# EAGLE design controller_2L_up (EAGLE 5.00)
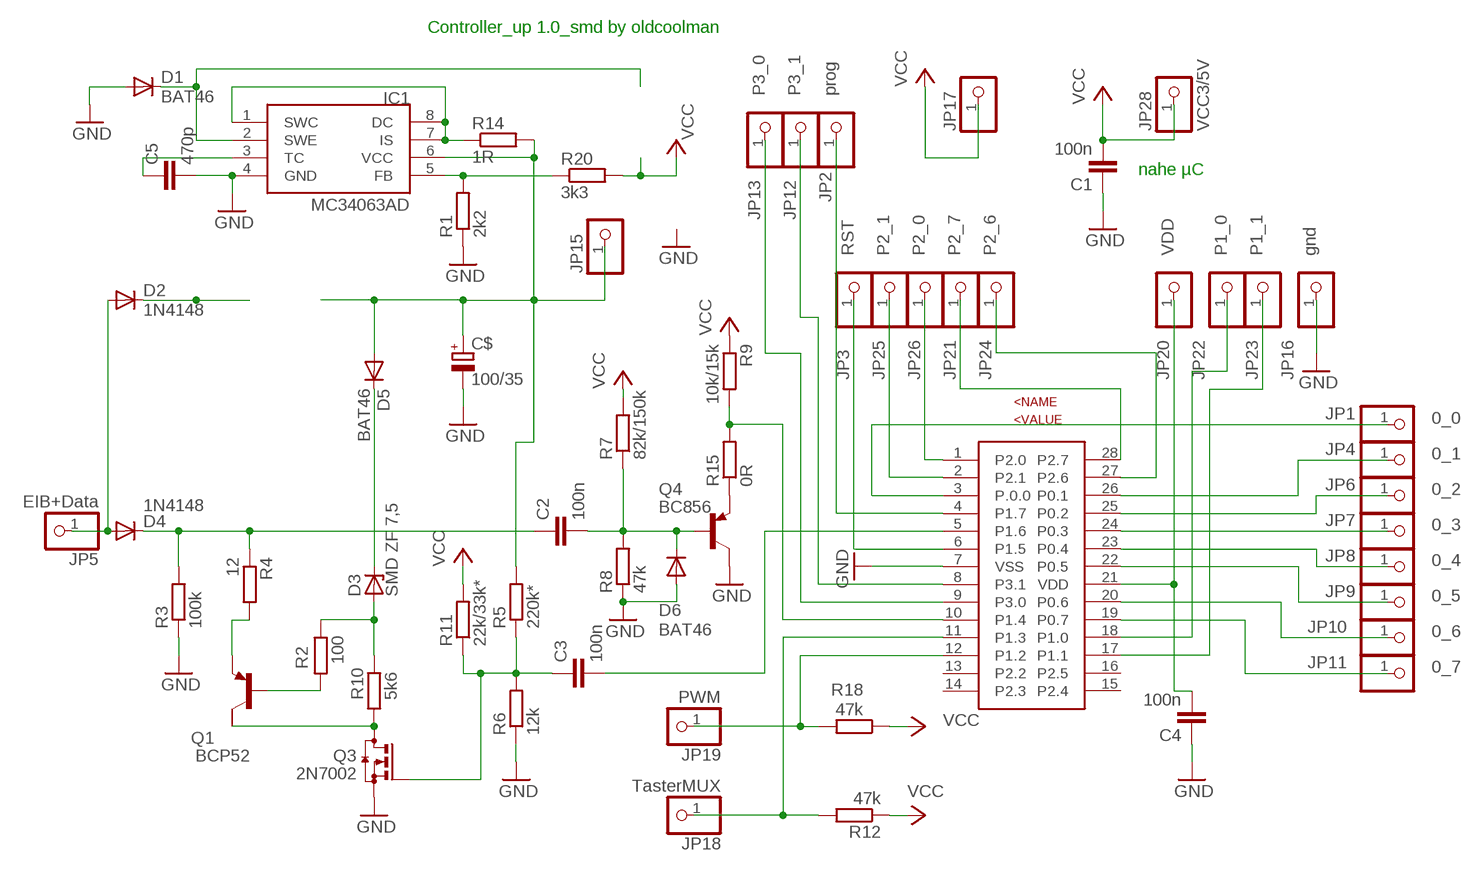
[diagram p0: schematic, sheet 1]

## Parts
C1  100n  C-EUC1206  [C1206]
C2  100n  C-EUC1206  [C1206]
C3  100n  C-EUC1206  [C1206]
C4  100n  C-EUC1206  [C1206]
C5  470p  C-EUC1206  [C1206]
C$  100/35  C_EU_HE3,3X13LIEGEND  [E3,3-7,5X13]
D1  BAT46  DIODE-MINIMELF  [MINIMELF]
D2  1N4148  DIODE-MINIMELF  [MINIMELF]
D3  SMD ZF 7,5  ZPD  [MINIMELF]
D4  1N4148  DIODE-MINIMELF  [MINIMELF]
D5  BAT46  DIODE-MINIMELF  [MINIMELF]
D6  BAT46  DIODE-MINIMELF  [MINIMELF]
IC1  MC34063AD  [SOIC8]
JP1  0_0  PINHD-1X1  [1X01]
JP2  prog  PINHD-1X1  [1X01]
JP3  RST  PINHD-1X1  [1X01]
JP4  0_1  PINHD-1X1  [1X01]
JP5  EIB+Data  PINHD-1X1  [1X01]
JP6  0_2  PINHD-1X1  [1X01]
JP7  0_3  PINHD-1X1  [1X01]
JP8  0_4  PINHD-1X1  [1X01]
JP9  0_5  PINHD-1X1  [1X01]
JP10  0_6  PINHD-1X1  [1X01]
JP11  0_7  PINHD-1X1  [1X01]
JP12  P3_1  PINHD-1X1  [1X01]
JP13  P3_0  PINHD-1X1  [1X01]
JP15  PINHD-1X1  [1X01]
JP16  gnd  PINHD-1X1  [1X01]
JP17  PINHD-1X1  [1X01]
JP18  TasterMUX  PINHD-1X1  [1X01]
JP19  PWM  PINHD-1X1  [1X01]
JP20  VDD  PINHD-1X1  [1X01]
JP21  P2_7  PINHD-1X1  [1X01]
JP22  P1_0  PINHD-1X1  [1X01]
JP23  P1_1  PINHD-1X1  [1X01]
JP24  P2_6  PINHD-1X1  [1X01]
JP25  P2_1  PINHD-1X1  [1X01]
JP26  P2_0  PINHD-1X1  [1X01]
JP28  VCC3/5V  PINHD-1X1  [1X01]
Q1  BCP52  FZT753SMD  [SOT223]
Q3  2N7002  BSS123  [SOT23]
Q4  BC856  BC856ALT1SMD  [SOT23-BEC]
R1  2k2  R-EU_R1206  [R1206]
R2  100  R-EU_M1206  [M1206]
R3  100k  R-EU_M1206  [M1206]
R4  12  R-EU_R1206  [R1206]
R5  220k*  R-EU_R1206  [R1206]
R6  12k  R-EU_M1206  [M1206]
R7  82k/150k  R-EU_R1206  [R1206]
R8  47k  R-EU_M1206  [M1206]
R9  10k/15k  R-EU_R1206  [R1206]
R10  5k6  R-EU_M1206  [M1206]
R11  22k/33k*  R-EU_R1206  [R1206]
R12  47k  R-EU_M1206  [M1206]
R14  1R  R-EU_M1206  [M1206]
R15  0R  R-EU_M1206  [M1206]
R18  47k  R-EU_M1206  [M1206]
R20  3k3  R-EU_M1206  [M1206]
U$1  LPC936TSSOP28  [TSSOP28]

## Nets
GND: C1.1 C4.1 C5.2 C$.- D1.A D6.A IC1.4(GND) JP16.1 Q3.2(S) Q4.C R1.1 R3.1 R6.1 R8.1 U$1.7(VSS)
N$1: R9.2 R15.2 U$1.10(P1.4)
N$2: C2.2 D6.C Q4.B R7.1 R8.2
N$3: IC1.5(FB) R1.2 R20.1
N$4: IC1.1(SWC) IC1.7(IS) IC1.8(DC) R14.1
N$5: C3.2 U$1.5(P1.6)
N$6: Q1.2(C) Q3.3(D) R10.1
N$7: C$.+ D5.A IC1.6(VCC) JP15.1 R5.2 R14.2
N$8: D2.C
N$9: C2.1 D4.C R3.2 R4.1
N$10: D1.C IC1.2(SWE)
N$11: D3.A R2.1 R10.2
N$12: Q1.3(E) R4.2
N$13: C5.1 IC1.3(TC)
N$14: Q1.1(B) R2.2
N$15: JP2.1 U$1.4(P1.7)
N$16: JP21.1 U$1.28(P2.7)
N$17: JP4.1 U$1.26(P0.1)
N$18: JP1.1 U$1.3(P.0.0)
N$19: JP6.1 U$1.25(P0.2)
N$20: JP7.1 U$1.24(P0.3)
N$21: JP8.1 U$1.23(P0.4)
N$22: JP9.1 U$1.22(P0.5)
N$23: JP10.1 U$1.20(P0.6)
N$24: JP11.1 U$1.19(P0.7)
N$25: JP12.1 U$1.8(P3.1)
N$26: JP13.1 U$1.9(P3.0)
N$28: D2.A D4.A JP5.1
N$29: JP22.1 U$1.18(P1.0)
N$30: JP23.1 U$1.17(P1.1)
N$31: JP3.1 U$1.6(P1.5)
N$32: C4.2 JP20.1 U$1.21(VDD)
N$33: JP19.1 R18.2 U$1.12(P1.2)
N$34: C3.1 Q3.1(G) R5.1 R6.2 R11.1
N$35: Q4.E R15.1
N$36: JP24.1 U$1.27(P2.6)
N$37: JP26.1 U$1.1(P2.0)
N$38: JP25.1 U$1.2(P2.1)
N$40: D3.C D5.C
N$42: JP18.1 R12.2 U$1.11(P1.3)
VCC: C1.2 JP17.1 JP28.1 R7.2 R9.1 R11.2 R12.1 R18.1 R20.2
Unconnected: Q1.4(C/) U$1.13(P2.2) U$1.14(P2.3) U$1.15(P2.4) U$1.16(P2.5)

## Notes on the sheet
- Controller_up 1.0_smd by oldcoolman
- nahe µC

## Library data of the parts
C1-C5 = rcl:C-EU: CAPACITOR, European symbol
C$ = rcl:C_EU_H
D1 D2 D4-D6 = diode:DIODE-: DIODE
D3 = diode:ZPD: Z DIODE 500 mW
IC1 = mc34063:MC34063
JP1-JP13 JP15-JP26 JP28 = pinhead:PINHD-1X1: PIN HEADER
Q1 = transistor-pnp:FZT753SMD: PNP Transistor
Q3 = transistor-small-signal:BSS123: N-CHANNEL MOS FET
Q4 = transistor-pnp:BC856*: PNP Transistror
R1-R12 R14 R15 R18 R20 = rcl:R-EU_: RESISTOR, European symbol
U$1 = freebuslpc:LPC936: C51 Based Microcontroller LPC936 ADC and 16kbyte Flash

## Board
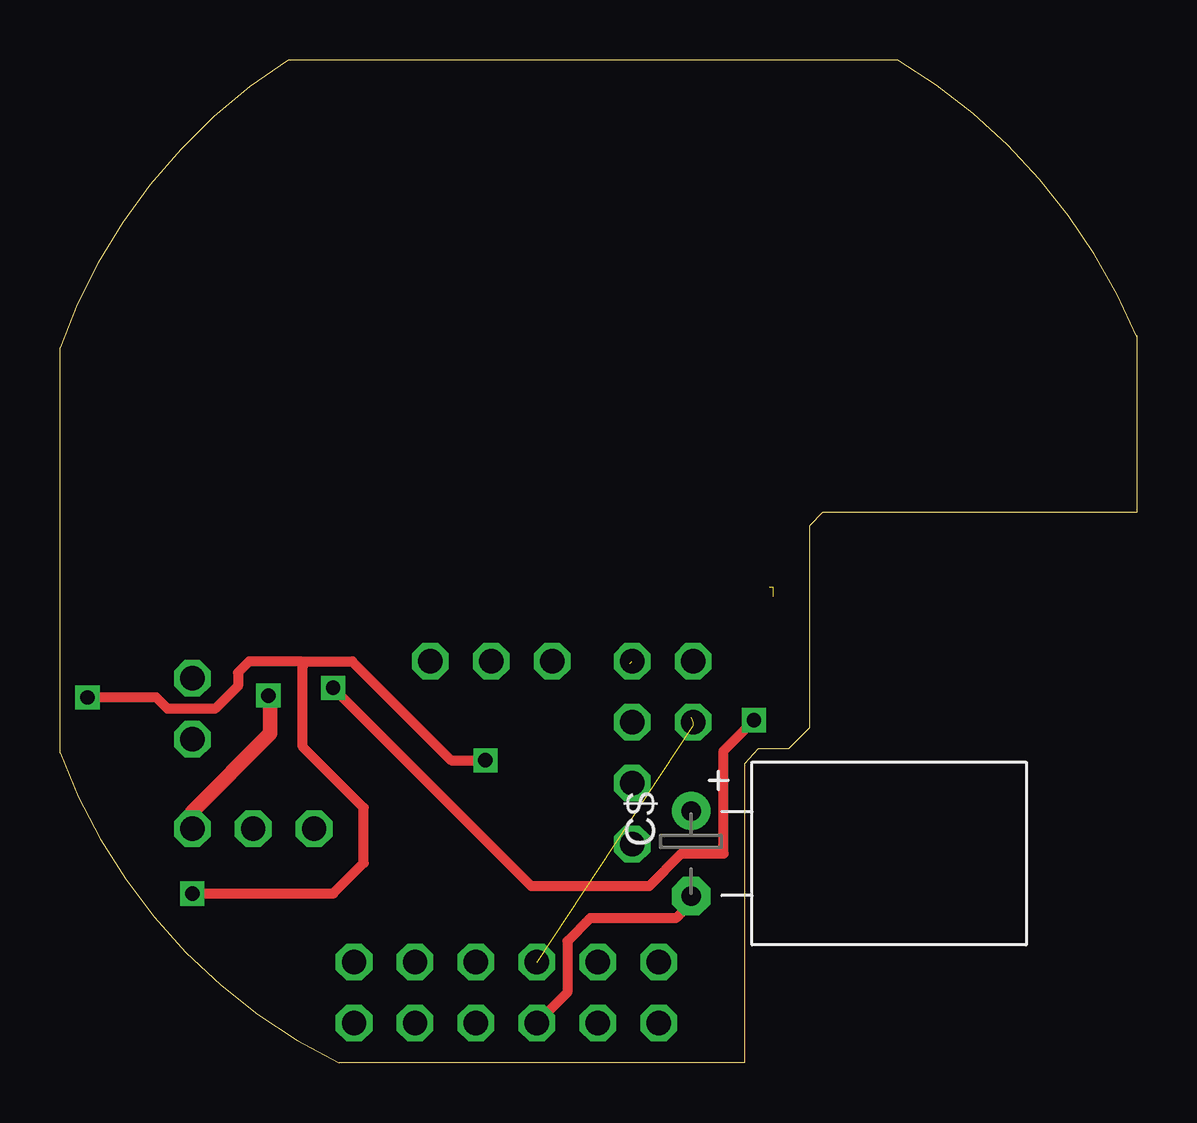
[diagram p1: board, top side]
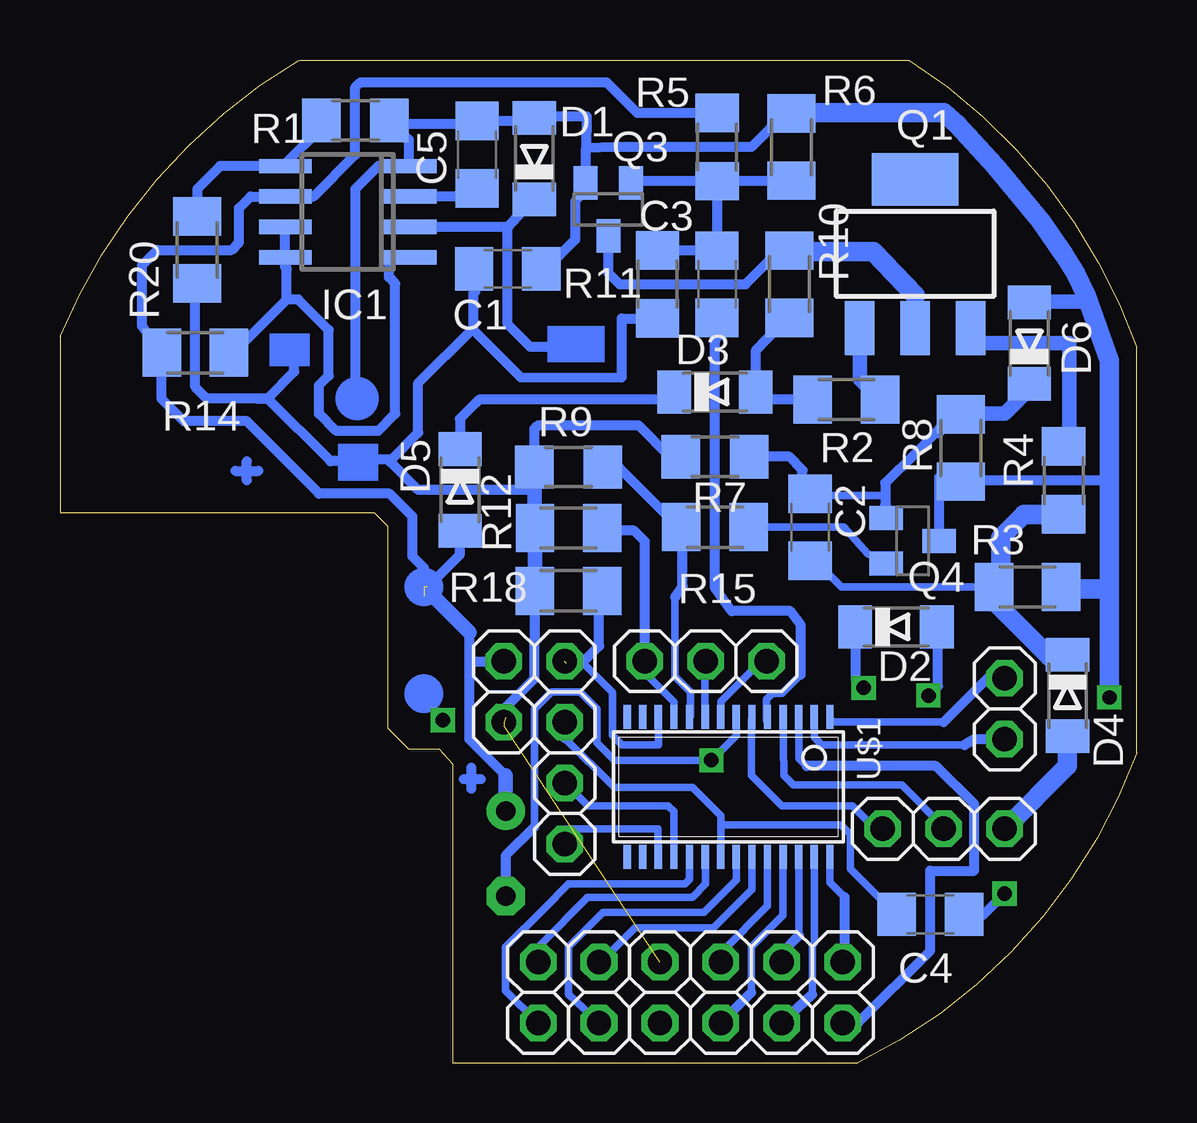
[diagram p2: board, bottom side, seen from below]

Size 44.89 x 41.81 mm. Coordinates in mm from the lower left corner, seen from the top.
Outline: 34.91,41.81 9.5,41.81 arc38 0,29.82
Outline: 0.01,12.92 0,29.81
Outline: 44.89,30.28 arc36 34.92,41.81
Outline: 0.01,12.93 arc44 11.63,0 28.53,0 28.53,4.92 28.53,12.46 29.09,13.1 30.36,13.1 31.23,13.97 31.23,22.38 31.79,22.94 44.88,22.94 44.88,30.32
Copper layers (1*16): Top 0.035mm / dielectric 1.5mm / Bottom 0.035mm
Design rules "default": minimum track width 10mil, minimum drill 24mil, track to track 8mil, track to pad 8mil, pad to pad 8mil, via to via 8mil, smd to smd 8mil, copper to edge 40mil, drill to drill 8mil, minimum pad ring 10mil, minimum via ring 8mil, stop-mask expansion 4mil, vias tented up to drill 0mil, thermal gap 10mil

### Footprints (pad centres in the part's own frame; a part is rotated, then mirrored left to right if it is on the bottom)
C1206 = smd 1.6 x 1.8: 1 -1.4,0; 2 1.4,0
E3,3-7,5X13 = drill 0.813 pad 1.6 round: + -1.778,0 | drill 0.813 pad 1.6 octagon: - 1.778,0
MINIMELF = smd 1.4 x 1.8: A 1.7,0; C -1.7,0
SOIC8 = smd 0.6 x 2.2: 1 -1.905,-2.6; 2 -0.635,-2.6; 3 0.635,-2.6; 4 1.905,-2.6; 5 1.905,2.6; 6 0.635,2.6; 7 -0.635,2.6; 8 -1.905,2.6
1X01 = drill 1.016 octagon: 1 0,0
SOT223 = smd 1.219 x 2.235: 1 -2.311,-3.099; 2 0,-3.099; 3 2.311,-3.099 | smd 3.6 x 2.2: 4 0,3.099
SOT23 = smd 1 x 1.4: 1 -0.95,-1.1; 2 0.95,-1.1; 3 0,1.1
SOT23-BEC = smd 1 x 1.4: B -0.95,-1.1; C 0,1.1; E 0.95,-1.1
R1206 = smd 1.6 x 1.803: 1 -1.422,0; 2 1.422,0
M1206 = smd 1.6 x 2: 1 -1.4,0; 2 1.4,0
TSSOP28 = smd 0.305 x 0.991: 1 -4.225,-2.918; 2 -3.575,-2.918; 3 -2.925,-2.918; 4 -2.275,-2.918; 5 -1.625,-2.918; 6 -0.975,-2.918; 7 -0.325,-2.918; 8 0.325,-2.918; 9 0.975,-2.918; 10 1.625,-2.918; 11 2.275,-2.918; 12 2.925,-2.918; 13 3.575,-2.918; 14 4.225,-2.918; 15 4.225,2.918; 16 3.575,2.918; 17 2.925,2.918; 18 2.275,2.918; 19 1.625,2.918; 20 0.975,2.918; 21 0.325,2.918; 22 -0.325,2.918; 23 -0.975,2.918; 24 -1.625,2.918; 25 -2.275,2.918; 26 -2.925,2.918; 27 -3.575,2.918; 28 -4.225,2.918

### Placement (x,y rotation side)
C1  26.23,33.1 180 bottom
C2  13.62,22.33 90 bottom
C3  17.5,32.46 270 bottom
C4  8.61,6.19 180 bottom
C5  27.5,37.86 90 bottom
C$  26.31,8.73 270 top
D1  25.12,37.7 90 bottom
D2  10.04,18.18 0 bottom
D3  17.59,27.97 0 bottom
D4  2.89,15.32 270 bottom
D5  28.21,23.89 270 bottom
D6  4.48,30 90 bottom
IC1  32.9,35.48 90 bottom
JP1  12.26,1.67 0 bottom
JP2  8.05,9.76 0 bottom
JP3  10.59,9.76 0 bottom
JP4  14.8,4.21 0 bottom
JP5  5.51,9.76 0 bottom
JP6  17.34,1.67 0 bottom
JP7  17.34,4.21 0 bottom
JP8  22.42,4.21 0 bottom
JP9  22.42,1.67 0 bottom
JP10  24.96,4.21 0 bottom
JP11  24.96,1.67 0 bottom
JP12  15.44,16.75 0 bottom
JP13  17.98,16.75 0 bottom
JP15  26.39,16.75 0 bottom
JP16  19.88,1.67 0 bottom
JP17  26.39,14.21 0 bottom
JP18  20.52,16.75 0 bottom
JP19  23.85,16.75 0 bottom
JP20  23.85,14.21 0 bottom
JP21  12.26,4.21 0 bottom
JP22  23.85,11.66 0 bottom
JP23  23.85,9.13 0 bottom
JP24  14.8,1.67 0 bottom
JP25  5.51,13.49 0 bottom
JP26  5.51,16.03 0 bottom
JP28  19.88,4.21 0 bottom
Q1  9.24,33.73 0 bottom
Q3  22.03,35.58 180 bottom
Q4  9.35,21.76 270 bottom
R1  32.58,39.29 180 bottom
R2  12.11,27.65 0 bottom
R3  4.56,19.84 180 bottom
R4  3.05,24.29 90 bottom
R5  17.5,38.18 90 bottom
R6  14.4,38.18 270 bottom
R7  17.59,25.27 180 bottom
R8  7.34,25.64 90 bottom
R9  23.69,24.84 0 bottom
R10  14.48,32.46 270 bottom
R11  19.98,32.46 270 bottom
R12  23.69,22.3 0 bottom
R14  39.25,29.61 180 bottom
R15  17.59,22.33 180 bottom
R18  23.69,19.68 0 bottom
R20  39.17,33.89 270 bottom
U$1  17.02,11.51 180 bottom

### Tracks (layer width: path | path; a pad name or v marks a point on that pad's centre or on a via)
GND  (via drill 0.6)
  Top 0.406: JP16.1 | JP16.1 21.15,2.94 21.15,5.08 22.1,6.03 25.67,6.03 26.55,6.91 C$.- | v17.74,12.62 16.31,12.62 12.18,16.75 10.04,16.75 | 10.04,16.75 10.12,16.51 10.12,13.18 12.66,10.64 12.66,8.33 11.39,7.06 v5.51,7.06 | 10.04,16.75 7.89,16.75 7.42,16.27 7.42,15.72 6.47,14.76 4.48,14.76 4,15.24 v1.15,15.24
  Bottom 0.254: 1.94,31.92 1.94,31.91 | 1.94,31.92 1.95,31.92 | 2.1,31.99 1.94,31.92
  Bottom 0.305: U$1.7 16.7,13.66 v17.74,12.62 21.78,12.62 22.5,13.33 22.5,14.76 23.21,15.47 24.4,15.47 25.12,14.76 25.12,11.67 | 25.12,11.67 25.12,9.84 | 25.12,11.67 | C4.1 7.13,5.98
  Bottom 0.406: 30.36,38.49 R1.1 | 30.36,38.49 30.36,37.39 | 30.36,37.39 IC1.4 | 30.36,37.39 31.63,37.39 32.58,36.43 32.58,27.86 | 1.15,19.76 1.15,18.97 0.99,19.29 | 30.36,38.49 30.36,38.5 30.99,39.13 27.66,39.13 27.5,39.29 C5.2 25.31,39.26 25.16,39.4 D1.A 24.85,39.4 24.8,39.45 22.92,39.45 22.94,38.13 | 2.6,19.76 R3.1 | 25.12,9.84 26.31,8.65 C$.- | 1.15,24.29 0.99,24.37 1.07,24.29 6.59,24.29 7.42,24.45 7.23,24.24 R8.1 7.49,24.51 8.25,24.42 Q4.C | 1.15,24.29 | 22.94,38.13 21.78,38.18 16.07,38.18 14.64,39.61 14.61,39.58 R6.1 14.24,39.61 | 22.94,38.13 22.98,38.09 Q3.2 22.98,36.36 23.42,35.92 23.42,34.32 24.64,33.1 C1.1 | 1.92,31.93 1.93,31.93 1.95,31.92 2.12,31.74 | 7.26,6.19 C4.1 6.39,6.19 v5.51,7.06 | v1.15,15.24 1.15,15.48 | v17.74,12.62
  Bottom 0.61: D6.A 4.33,31.74 4.32,31.75 4.32,31.74 2.12,31.74
  Bottom 0.813: 2.6,19.76 1.15,19.76 1.15,15.48 1.15,15.32 | 1.15,18.97 1.15,24.29 1.15,29.29 2.1,31.99 2.58,32.94 3.02,33.67 4,35.08 5.91,37.39 7.5,39.13 8.05,39.61 14.24,39.61
N$1
  Bottom 0.305: 19.25,19.42 19.24,18.1 19.24,16.11 18.61,15.48 18.61,14.45 18.65,14.41 U$1.10
  Bottom 0.406: R9.2 22.11,24.69 21.95,24.84 21.61,24.84 19.17,22.41 19.07,22.41 R15.2 | 19.41,22.57 19.3,22.46 R15.2 | R15.2 18.94,22.28 18.94,19.87 19.25,19.42
N$2
  Bottom 0.305: 13.86,23.84 13.62,23.84 13.54,23.65 11.8,23.65 10.46,23.65 Q4.B
  Bottom 0.406: R7.1 14.49,25.27 13.94,24.71 13.94,23.92 13.86,23.84 13.94,23.76 C2.2 | R8.2 8.29,26.24 8.22,26.45 9.24,25.4 10.48,24.18 10.48,23.25 10.45,23.22 Q4.B | 4.62,28.45 4.51,28.35 D6.C
  Bottom 0.61: 4.62,28.45 4.62,27.96 5.51,27.07 7.26,27.07 7.28,27.04 R8.2
N$3
  Bottom 0.406: R20.1 39.17,36.43 38.22,37.39 IC1.5 35.5,37.48 34.01,38.97 R1.2
N$4
  Bottom 0.406: IC1.1 31.15,33.58 31.18,32.75 30.91,32.49 30.91,27.07 31.63,26.35 | IC1.7 35.5,33.16 35.44,33.1 | R14.1 37.66,29.61 35.44,31.83 | 35.44,33.1 IC1.8 | 35.44,31.83 35.44,33.1 | 35.44,31.83 35.44,31.99 | 31.63,26.35 | 31.63,26.35 33.37,26.35 34.09,27.07 34.09,28.26 33.69,28.65 33.69,30.56 34.96,31.83 35.44,31.83
N$5
  Bottom 0.305: 15.43,14.45 15.4,14.41 U$1.5 15.42,14.29 15.43,14.29 15.43,15.16 15.2,15.4 14.8,15.4 14.01,16.19
  Bottom 0.406: C3.2 17.45,30.35 17.59,30.09 17.59,19.79 16.9,18.83 14.45,18.83 14.01,18.26 14.01,16.19
N$6
  Bottom 0.406: R10.1 14.56,33.73 15.04,33.73 16.31,32.46 16.34,32.46 16.35,32.45 21.55,32.45 22.03,32.93 Q3.3 | Q1.2 | 9.24,31.99 | Q1.2 9.24,31.99 | 14.43,33.81 R10.1 | R10.1
  Bottom 0.813: 9.24,31.99 10.99,33.81 14.43,33.81
N$7  (2 unrouted)
  Bottom 0.406: 27.82,16.83 27.82,17.94 | 40.68,29.61 | 40.68,29.61 R14.2 40.65,27.67 39.72,26.75 37.1,26.75 34.09,23.73 31.15,23.73 30.2,22.78 30.2,21.11 29.72,20.64 29.72,19.45 | 40.68,29.61 41.47,30.72 41.47,33.26 40.83,33.89 37.74,33.89 37.42,34.21 37.42,35.64 36.95,36.12 IC1.6 34.33,36.12 32.58,37.86 32.58,40.67 32.37,40.88 22.1,40.88 20.83,39.61 R5.2 | 29.72,19.45 | C$.+ 26.47,10.32 | 27.82,16.83 27.82,15.8 27.82,13.49 26.31,11.99 | JP15.1 27.82,16.74 27.82,16.83 | D5.A 28.21,21.19 29.56,19.84 | R5.2 | R5.2
  Bottom 0.61: 27.82,17.94 29.72,19.84 | C$.+ 26.31,11.99
N$8  (via drill 0.6)
  Top 0.406: v28.93,14.29 27.66,13.02 27.66,8.73 25.91,8.73 24.56,7.38 19.64,7.38 v11.39,15.64
  Bottom 0.406: 11.7,18.21 11.7,18.26 | 11.7,18.21 D2.C | v11.39,15.64 11.7,15.95 11.7,18.21
N$9
  Bottom 0.305: C2.1 13.41,20.93 12.32,19.84 5.75,19.84 5.67,19.92 5.59,19.84 R3.2 | 3.05,22.86 R4.1
  Bottom 0.406: R3.2 5.59,19.87
  Bottom 0.813: 5.67,19.92 5.67,21.91 4.72,22.86 3.05,22.86 | D4.C 3.64,16.94 5.83,19.13 5.83,19.76 5.59,19.84 R3.2
N$10
  Bottom 0.406: D1.C 25.44,35.72 26.23,34.85 | 26.23,34.85 IC1.2 | 26.23,34.85 26.23,30.8 25.28,29.84 24.32,29.84
N$11
  Bottom 0.406: R10.2 14.43,31.11 14.54,31.11 15.87,29.72 D3.A 15.57,27.65 R2.1 | R2.1 13.46,27.65 | R2.1
N$12
  Bottom 0.305: 3.05,25.64 | R4.2 3.05,25.64
  Bottom 0.406: 3.05,25.88 R4.2 | Q1.3
  Bottom 0.61: 3.05,25.88 2.89,25.88 2.81,26.35 2.81,30 6.78,30 6.78,30.56 6.86,30.64 6.87,30.64 Q1.3
N$13
  Bottom 0.406: IC1.3 30.67,36.12 | IC1.3 30.04,36.12 | C5.1 27.63,36.46 28.45,36.12 IC1.3
N$14
  Bottom 0.61: 10.75,27.69 R2.2 | R2.2 10.67,27.62 | Q1.1 11.55,28.5 R2.2
N$15
  Bottom 0.305: U$1.4 14.72,11.99 14.32,11.59 9.8,11.59 7.97,9.76 JP2.1
N$16
  Bottom 0.305: U$1.28 12.8,7.52 12.18,6.91 | JP21.1 12.18,4.52
  Bottom 0.406: 12.18,4.52 12.18,6.91
N$17
  Bottom 0.305: U$1.26 14.1,8.43 14.09,8.41 14.09,5.32
  Bottom 0.406: JP4.1 14.72,4.68 14.09,5.32
N$18
  Bottom 0.305: U$1.3 14.09,14.27 14.09,12.7 13.77,12.38
  Bottom 0.406: JP1.1 11.62,1.67 8.61,4.68 8.61,8.02 6.78,8.02 6.78,10.79 8.37,12.38 13.77,12.38
N$19
  Bottom 0.305: U$1.25 14.75,6.16 16.07,4.84 16.07,2.94
  Bottom 0.406: JP6.1 16.07,2.94
N$20
  Bottom 0.305: U$1.24 15.4,6.55 17.26,4.68
  Bottom 0.406: JP7.1 17.26,4.68
N$21
  Bottom 0.305: U$1.23 16.05,7.25 17.66,5.64 20.91,5.64 22.18,4.37 JP8.1
N$22
  Bottom 0.305: U$1.22 16.7,7.63 18.05,6.27 22.26,6.27 23.69,4.84 23.69,2.86 JP9.1 22.34,1.83
N$23
  Bottom 0.305: U$1.20 17.97,8.43 17.97,7.46 18.53,6.91 22.9,6.91 24.86,4.92 24.88,4.66
  Bottom 0.406: 24.88,4.66 JP10.1
N$24
  Bottom 0.305: U$1.19 18.65,7.66 18.85,7.46 23.69,7.46 24.72,6.43 26.31,4.84 26.31,3.02 JP11.1
N$25
  Bottom 0.305: U$1.8 17.34,14.28 17.34,15.08 15.59,16.83 JP12.1 15.43,16.67 JP12.1
N$26
  Bottom 0.305: JP13.1 18,15.77 U$1.9
N$28  (via drill 0.6)
  Top 0.61: JP5.1 5.51,10.48 8.77,13.73 8.77,15.4 v8.69,15.32
  Bottom 0.406: D2.A 8.29,18.18 8.29,15.72 v8.69,15.32
  Bottom 0.813: D4.A 2.89,12.38 JP5.1 | JP5.1
  other vias: 5.51,9.76
N$29
  Bottom 0.305: 23.85,11.83 JP22.1 23.83,11.91 23.82,11.67 22.87,10.72 19.54,10.72 19.3,10.48 U$1.18
N$30
  Bottom 0.305: U$1.17 19.96,8.43 19.96,9.76 22.26,9.76 23.85,9.76 JP23.1
N$31
  Bottom 0.305: U$1.6 16.07,14.25 16.07,11.99 14.8,10.72 11.86,10.72 10.67,9.52 10.59,9.68 10.51,9.52 JP3.1
N$32
  Bottom 0.305: 23.85,13.54 21.78,11.48 18.53,11.48 17.35,10.3 U$1.21 17.35,9.76 17.26,9.92 12.34,9.92 11.94,9.52 11.94,8.1 9.96,6.11 C4.2
  Bottom 0.406: 23.85,13.54 JP20.1
N$33  (1 unrouted)
  Bottom 0.305: U$1.12 19.95,13.27 19.96,13.26 21.47,13.26 21.86,13.65 21.86,15.45 23.21,16.8 23.77,16.67
  Bottom 0.406: R18.2 22.42,18.78 22.42,17.38 23.08,16.72 23.77,16.67
N$34
  Bottom 0.406: C3.1 | R5.1 | R5.1 14.41,36.76 14.4,36.75 | R5.1 C3.1 | 14.4,36.75 | R6.2 14.4,36.75 | Q3.1 21.02,36.68 21.02,36.75 R5.1 | R11.1 19.95,33.92 19.9,33.86 C3.1
N$35
  Bottom 0.305: Q4.E 11.21,21.21 12.22,22.33 R15.1
N$36
  Bottom 0.305: U$1.27 13.45,8.42 13.45,8.41 13.45,5 13.53,4.84 13.53,2.86
  Bottom 0.406: JP24.1 13.53,2.86
N$37
  Bottom 0.305: U$1.1 12.74,14.21 8.05,14.21
  Bottom 0.406: 8.05,14.21 6.23,16.03 JP26.1
N$38
  Bottom 0.305: U$1.2 13.45,14.27 13.45,13.57 13.13,13.26 7.18,13.26
  Bottom 0.406: 7.18,13.26 6.78,13.49 JP25.1
N$39
  Bottom 0.406: 37.1,24.29 37.1,25.08
N$40
  Bottom 0.406: 28.13,25.59 D5.C 28.21,25.64 28.13,25.72 28.21,25.8 28.21,26.85 27.5,27.57 27.42,27.65 19.82,27.65 19.5,27.97 D3.C
N$42
  Bottom 0.305: 22.18,22.2 R12.2 | U$1.11 19.3,15.05 20.44,16.19 20.44,16.67 JP18.1
  Bottom 0.406: 22.18,22.2 20.96,22.2 20.51,21.75 JP18.1 | JP18.1
N$43
  Bottom 0.406: 37.58,24.69 36.63,24.69
N$44
  Bottom 0.406: 27.74,11.43 27.74,12.3
N$46
  Bottom 0.406: 27.34,11.83 28.06,11.83
VCC  (3 unrouted)
  Bottom 0.305: 26.31,14.4
  Bottom 0.406: 38.9,32.49 R20.2 | 36.47,27.7 36.71,27.7 36.23,27.7 | 36.47,27.7 36.23,27.7 | 36.23,27.7 35.12,28.81 35.12,29.37 35.11,29.33 | 38.9,32.49 38.8,32.49 | 38.9,32.49 39.25,32.15 39.25,28.18 38.77,27.7 36.47,27.7 | 31.11,25.04 29.96,23.89 25.28,23.89 25.12,24.06 R9.1 25.11,24.05 25.12,23.89 25.12,26.43 24.96,26.59 20.78,26.59 19.54,25.35 19.02,25.35 R7.2 | 31.11,25.04 31.15,25.08 | C1.2 27.63,32.2 27.58,32.15 27.66,32.07 27.66,30.64 27.7,30.6 | JP17.1 26.39,14.76 25.12,16.03 25.12,17.62 25.09,17.65 R18.1 | 27.7,30.6 29.96,28.34 29.96,26.27 31.07,25.16 | 31.07,25.08 | 31.11,25.04 31.07,25.08 | 31.07,25.08 31.07,25.16 | 36.23,27.7 33.61,25.08 31.94,25.08 31.87,25.16 31.07,25.16 | R11.2 21.47,31.04 21.47,28.57 25.69,28.58 27.7,30.6 | 27.7,30.6 | 26.39,14.05
  Bottom 0.61: 25.09,22.28 25.04,22.22 | 25.09,22.28 R12.1 25.09,19.4 25.12,19.37 | 25.12,23.89 25.12,22.3 25.09,22.28 | 25.12,19.37 | R18.1 25.12,19.37
(copper drawn outside any net)
  shapes: Bottom area x3, Bottom circle x3